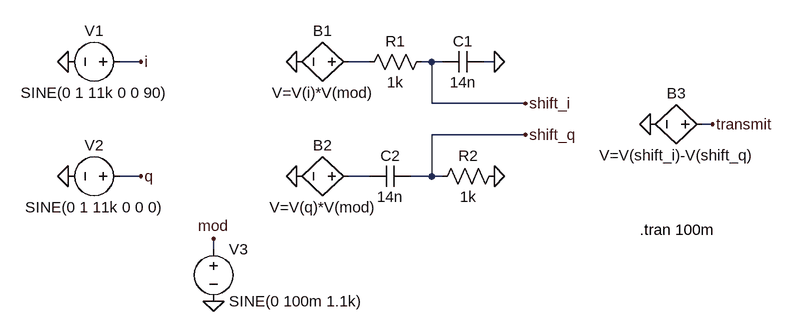
[diagram p0: schematic ssb.asc]
ssb.asc, the LTspice schematic file:
Version 4
SHEET 1 1264 680
WIRE 272 144 240 144
WIRE 624 144 592 144
WIRE 720 144 704 144
WIRE 736 144 720 144
WIRE 816 144 800 144
WIRE 720 208 720 144
WIRE 864 208 720 208
WIRE 1152 240 1136 240
WIRE 864 256 720 256
WIRE 272 320 240 320
WIRE 624 320 592 320
WIRE 720 320 720 256
WIRE 720 320 688 320
WIRE 736 320 720 320
WIRE 384 432 384 416
FLAG 160 144 0
FLAG 160 320 0
FLAG 272 144 i
FLAG 272 320 q
FLAG 384 512 0
FLAG 384 416 mod
FLAG 512 144 0
FLAG 512 320 0
FLAG 816 144 0
FLAG 816 320 0
FLAG 864 208 shift_i
FLAG 864 256 shift_q
FLAG 1056 240 0
FLAG 1152 240 transmit
SYMBOL voltage 256 144 R90
WINDOW 0 -32 56 VBottom 2
WINDOW 3 32 56 VTop 2
WINDOW 123 0 0 Left 0
WINDOW 39 0 0 Left 0
SYMATTR InstName V1
SYMATTR Value SINE(0 1 11k 0 0 90)
SYMBOL voltage 256 320 R90
WINDOW 0 -32 56 VBottom 2
WINDOW 3 32 56 VTop 2
WINDOW 123 0 0 Left 0
WINDOW 39 0 0 Left 0
SYMATTR InstName V2
SYMATTR Value SINE(0 1 11k 0 0 0)
SYMBOL voltage 384 416 R0
WINDOW 123 0 0 Left 0
WINDOW 39 0 0 Left 0
SYMATTR InstName V3
SYMATTR Value SINE(0 100m 1.1k)
SYMBOL bv 608 144 R90
WINDOW 0 -32 56 VBottom 2
WINDOW 3 32 56 VTop 2
SYMATTR InstName B1
SYMATTR Value V=V(i)*V(mod)
SYMBOL bv 608 320 R90
WINDOW 0 -32 56 VBottom 2
WINDOW 3 32 56 VTop 2
SYMATTR InstName B2
SYMATTR Value V=V(q)*V(mod)
SYMBOL res 720 128 R90
WINDOW 0 0 56 VBottom 2
WINDOW 3 32 56 VTop 2
SYMATTR InstName R1
SYMATTR Value 1k
SYMBOL cap 800 128 R90
WINDOW 0 0 32 VBottom 2
WINDOW 3 32 32 VTop 2
SYMATTR InstName C1
SYMATTR Value 14n
SYMBOL cap 688 304 R90
WINDOW 0 0 32 VBottom 2
WINDOW 3 32 32 VTop 2
SYMATTR InstName C2
SYMATTR Value 14n
SYMBOL res 832 304 R90
WINDOW 0 0 56 VBottom 2
WINDOW 3 32 56 VTop 2
SYMATTR InstName R2
SYMATTR Value 1k
SYMBOL bv 1152 240 R90
WINDOW 0 -32 56 VBottom 2
WINDOW 3 32 56 VTop 2
SYMATTR InstName B3
SYMATTR Value V=V(shift_i)-V(shift_q)
TEXT 1040 402 Left 2 !.tran 100m

The netlist it stands for:
* ssb.asc
V1 i 0 SINE(0 1 11k 0 0 90)
V2 q 0 SINE(0 1 11k 0 0 0)
V3 mod 0 SINE(0 100m 1.1k)
B1 N001 0 V=V(i)*V(mod)
B2 N002 0 V=V(q)*V(mod)
R1 shift_i N001 1k
C1 0 shift_i 14n
C2 shift_q N002 14n
R2 0 shift_q 1k
B3 transmit 0 V=V(shift_i)-V(shift_q)
.tran 100m
.backanno
.end